# Altium project Arm Power Distro Board (A).PrjPcb
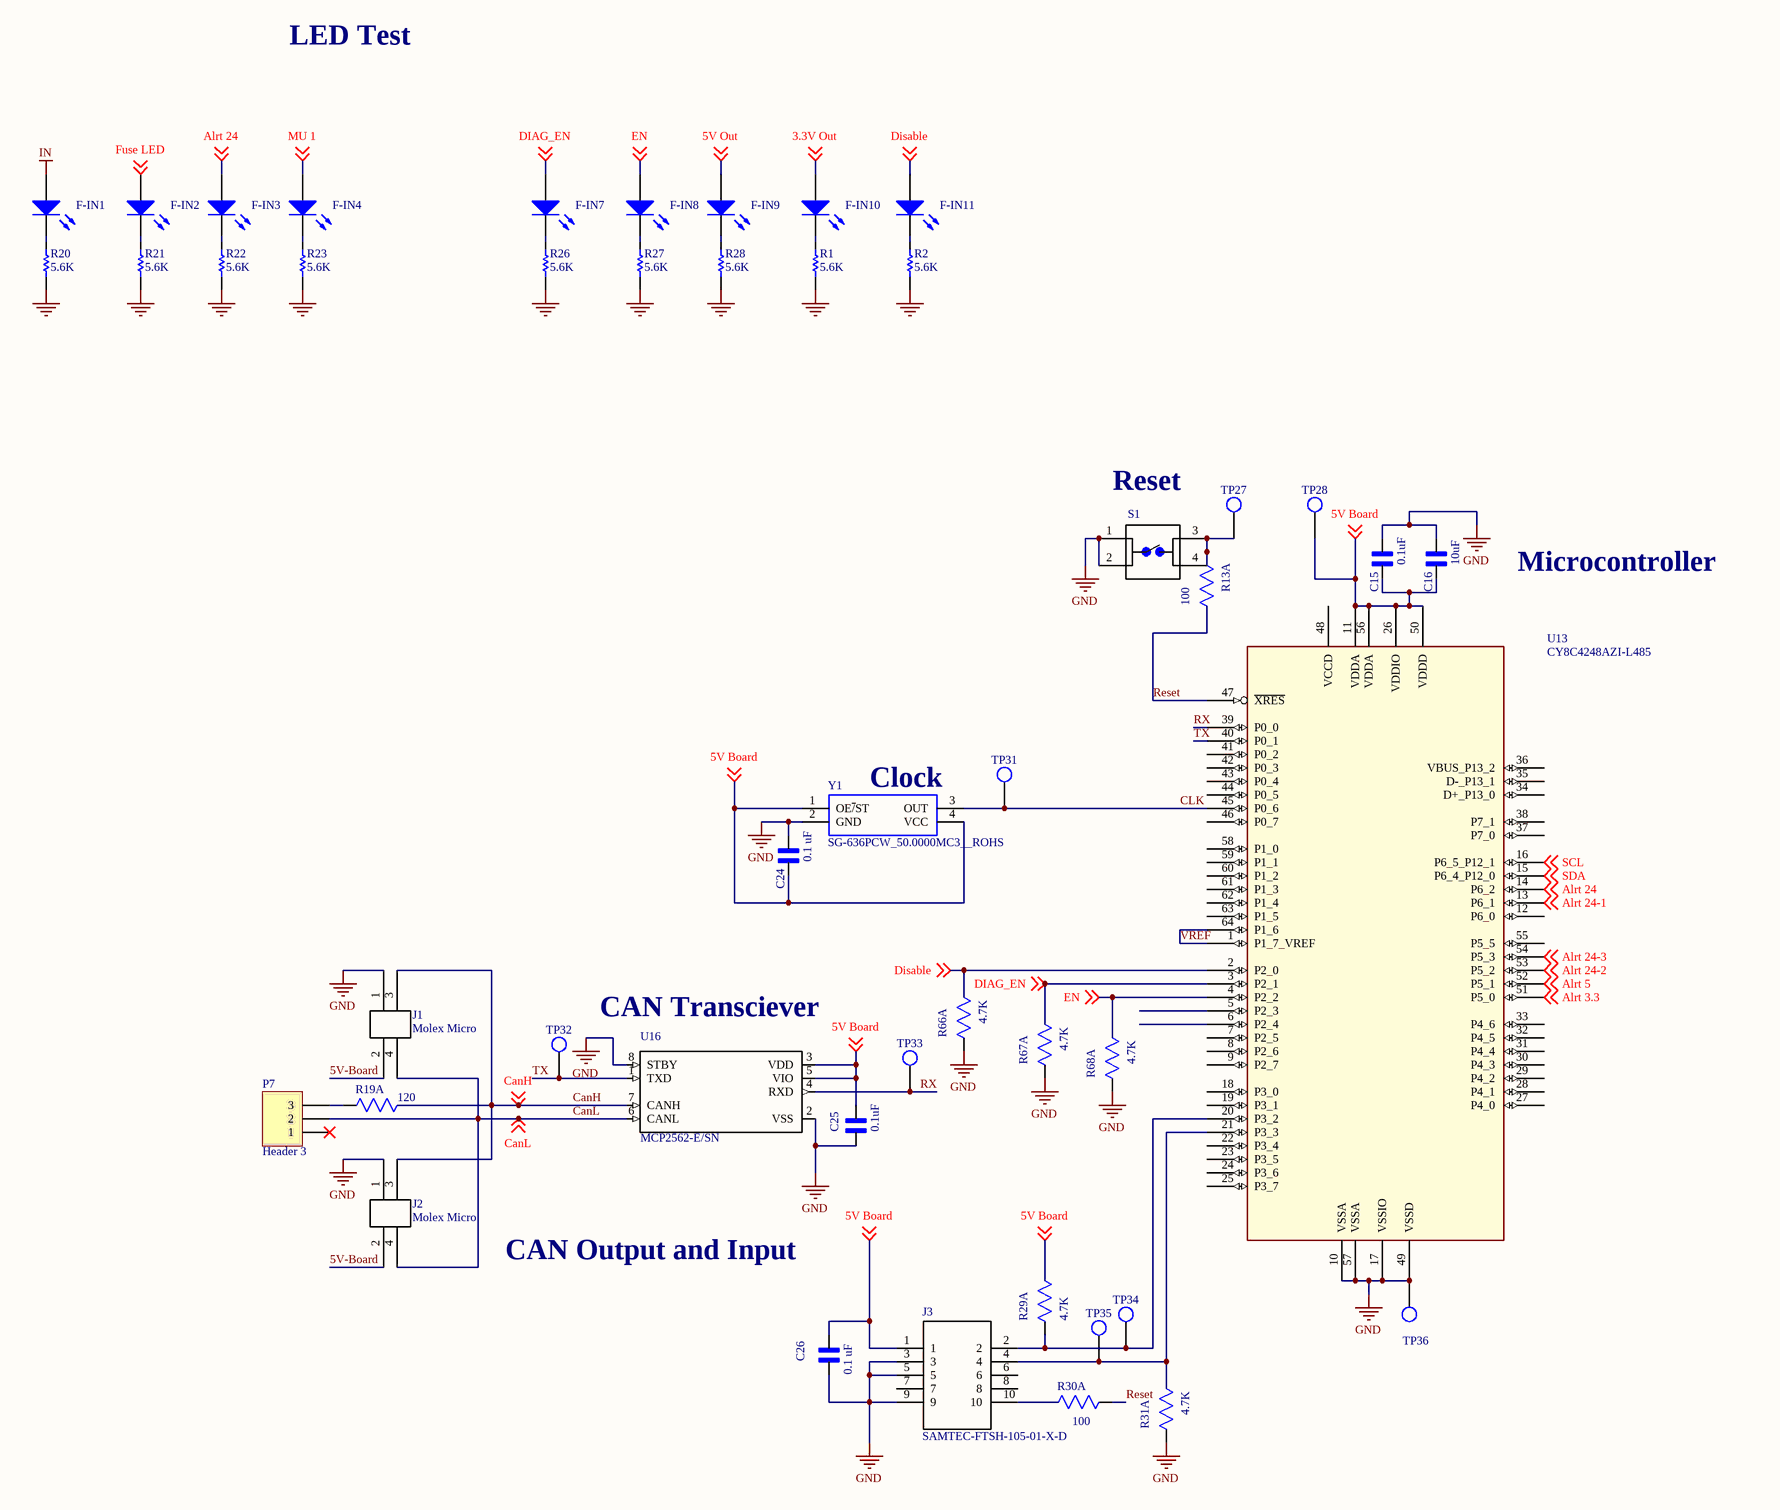
[diagram p0: Arm Power Distro Board (A).SchDoc]
6 sheets, 191 parts. Net scope: global (net labels, ports and power ports of the same name join across sheets).
Board file: Arm Power Distro Board (A).PcbDoc
Sheets:
  Arm Power Distro Board (A).SchDoc
  DC-DC Converters.SchDoc
  Input.SchDoc
  Output - Motor Units.SchDoc
  Linear Voltage Regulator.SchDoc
  Output - 24V.SchDoc

## Sheet Arm Power Distro Board (A).SchDoc
size C

### Parts
C15  0.1uF  [*CAPC2012X135N]
C16  10uF  [*CAPC2012X135N]
C24  0.1 uF  [*CAPC2012X135N]
C25  0.1uF  [*CAPC2012X135N]
C26  0.1 uF  [*CAPC2012X135N]
F-IN1  150060VS75000  [0603_A]  (value not drawn)
F-IN2  150060VS75000  [0603_A]  (value not drawn)
F-IN3  150060VS75000  [0603_A]  (value not drawn)
F-IN4  150060VS75000  [0603_A]  (value not drawn)
F-IN7  150060VS75000  [0603_A]  (value not drawn)
F-IN8  150060VS75000  [0603_A]  (value not drawn)
F-IN9  150060VS75000  [0603_A]  (value not drawn)
F-IN10  150060VS75000  [0603_A]  (value not drawn)
F-IN11  150060VS75000  [0603_A]  (value not drawn)
J1  Molex Micro  [0430450427]
J2  Molex Micro  [0430450427]
J3  SAMTEC-FTSH-105-01-X-D  [SAMTEC-FTSH-105-01-X-D]
P7  Header 3  [HDR1X3]
R1  5.6K  [RESC2013X60X35ML10T20]
R2  5.6K  [RESC2013X60X35ML10T20]
R13  100  [RC0805N]  (part A of 2)
R19  120  [RC0805N]  (part A of 2)
R20  5.6K  [RESC2013X60X35ML10T20]
R21  5.6K  [RESC2013X60X35ML10T20]
R22  5.6K  [RESC2013X60X35ML10T20]
R23  5.6K  [RESC2013X60X35ML10T20]
R26  5.6K  [RESC2013X60X35ML10T20]
R27  5.6K  [RESC2013X60X35ML10T20]
R28  5.6K  [RESC2013X60X35ML10T20]
R29  4.7K  [RC0805N]  (part A of 2)
R30  100  [RC0805N]  (part A of 2)
R31  4.7K  [RC0805N]  (part A of 2)
R66  4.7K  [RC0805N]  (part A of 2)
R67  4.7K  [RC0805N]  (part A of 2)
R68  4.7K  [RC0805N]  (part A of 2)
S1  1825910-7  [Switch 6mm 24V (NO)]  (value not drawn)
TP27  Test Point  [Test Point Through-hole]  (value not drawn)
TP28  Test Point  [Test Point Through-hole]  (value not drawn)
TP31  Test Point  [Test Point Through-hole]  (value not drawn)
TP32  Test Point  [Test Point Through-hole]  (value not drawn)
TP33  Test Point  [Test Point Through-hole]  (value not drawn)
TP34  Test Point  [Test Point Through-hole]  (value not drawn)
TP35  Test Point  [Test Point Through-hole]  (value not drawn)
TP36  Test Point  [Test Point Through-hole]  (value not drawn)
U13  CY8C4248AZI-L485  [TQFP50P1200X1200X160-64N]
U16  MCP2562-E/SN  [SOIC127P600X175-8N]
Y1  SG-636PCW_50.0000MC3__ROHS  [SG-636]

### Nets
5V Board: C15.1 C16.1 C24.1 C25.2 C26.2 J3.1 R29.2 TP28.1 U13.11(VDDA) U13.26(VDDIO) U13.50(VDDD) U13.56(VDDA) U16.3(VDD) U16.5(VIO) Y1.1(OE~{/}ST) Y1.4(VCC) ; off-sheet 5V Board  [project net 5V]
GND: C15.2 C16.2 C24.2 C25.1 C26.1 J1.1 J2.1 J3.3 J3.5 J3.9 R1.1 R2.1 R20.1 R21.1 R22.1 R23.1 R26.1 R27.1 R28.1 R31.1 R66.1 R67.1 R68.1 S1.1 S1.2 TP36.1 U13.10(VSSA) U13.17(VSSIO) U13.49(VSSD) U13.57(VSSA) U16.2(VSS) U16.8(STBY) Y1.2(GND)
IN: F-IN1.2(A)
3.3V Out: F-IN10.2(A) ; off-sheet 3.3V Out  [project net 3.3V-Out]
5V Out: F-IN9.2(A) ; off-sheet 5V Out  [project net 5V-Out]
5V-Board: J1.2 J2.2
Alrt 3.3: U13.51(P5_0) ; off-sheet Alrt 3.3
Alrt 5: U13.52(P5_1) ; off-sheet Alrt 5
Alrt 24: F-IN3.2(A) U13.14(P6_2) ; off-sheet Alrt 24
Alrt 24-1: U13.13(P6_1) ; off-sheet Alrt 24-1
Alrt 24-2: U13.53(P5_2) ; off-sheet Alrt 24-2
Alrt 24-3: U13.54(P5_3) ; off-sheet Alrt 24-3
CanH: J1.3 J2.3 R19.2 U16.7(CANH) ; off-sheet CanH
CanL: J1.4 J2.4 P7.2 U16.6(CANL) ; off-sheet CanL
CLK: TP31.1 U13.45(P0_6) Y1.3(OUT)
DIAG_EN: F-IN7.2(A) R67.2 U13.3(P2_1) ; off-sheet DIAG_EN
Disable: F-IN11.2(A) R66.2 U13.2(P2_0) ; off-sheet Disable  [project net 3.3V Disable]
EN: F-IN8.2(A) R68.2 U13.4(P2_2) ; off-sheet EN
Fuse LED: F-IN2.2(A) ; off-sheet Fuse LED
MU 1: F-IN4.2(A) ; off-sheet MU 1
Reset: R13.2 R30.1 U13.47(~{XRES})
RX: TP33.1 U13.39(P0_0) U16.4(RXD)
SCL: U13.16(P6_5_P12_1) ; off-sheet SCL
SDA: U13.15(P6_4_P12_0) ; off-sheet SDA
TX: TP32.1 U13.40(P0_1) U16.1(TXD)
VREF: U13.1(P1_7_VREF) U13.64(P1_6)
NetF-IN1_1: F-IN1.1(K) R20.2
NetF-IN2_1: F-IN2.1(K) R21.2
NetF-IN3_1: F-IN3.1(K) R22.2
NetF-IN4_1: F-IN4.1(K) R23.2
NetF-IN7_1: F-IN7.1(K) R26.2
NetF-IN8_1: F-IN8.1(K) R27.2
NetF-IN9_1: F-IN9.1(K) R28.2
NetF-IN10_1: F-IN10.1(K) R1.2
NetF-IN11_1: F-IN11.1(K) R2.2
NetJ3_2: J3.2 R29.1 TP34.1 U13.20(P3_2)
NetJ3_4: J3.4 R31.2 TP35.1 U13.21(P3_3)
NetJ3_10: J3.10 R30.2
NetP7_3: P7.3 R19.1
NetR13_1: R13.1 S1.3 S1.4 TP27.1

Not connected (* = marked no-connect by the designer): J3 6 7 8; P7 1*; U13 5(P2_3) 6(P2_4) 7(P2_5) 8(P2_6) 9(P2_7) 12(P6_0) 18(P3_0) 19(P3_1) 22(P3_4) 23(P3_5) 24(P3_6) 25(P3_7) 27(P4_0) 28(P4_1) 29(P4_2) 30(P4_3) 31(P4_4) 32(P4_5) 33(P4_6) 34(D+_P13_0) 35(D-_P13_1) 36(VBUS_P13_2) 37(P7_0) 38(P7_1) 41(P0_2) 42(P0_3) 43(P0_4) 44(P0_5) 46(P0_7) 48(VCCD) 55(P5_5) 58(P1_0) 59(P1_1) 60(P1_2) 61(P1_3) 62(P1_4) 63(P1_5)

### Notes on the sheet
- LED Test
- Reset
- Microcontroller
- (near Y1) Clock
- CAN Transciever
- CAN Output and Input

### Library data of the parts
C15 C16 C24-C26 = EMK212BJ225KG-T: / Cap Ceramic 2.2uF 16V X5R 10% SMD 0805 125Â°C Embossed T/R /; MF: Taiyo Yuden; MP: EMK212BJ225KG-T; Package: 2012 Taiyo Yuden; Digi-Key_Purchase_URL: https://www.digikey.com/product-detail/en/taiyo-yuden/EMK212BJ225KG-T/587-1293-1-ND/931070?utm_source=snapeda&utm_medium=aggregator&utm_campaign=symbol; Digi-Key_Part_Number: 587-1293-1-ND; SnapEDA_Link: https://www.snapeda.com/parts/EMK212BJ225KG-T/Taiyo%20Yuden/view-part/?ref=snap; Value: *
F-IN1-F-IN4 F-IN7-F-IN11 = CMP-1426-00006-1: SMD mono-color Chip LED, WL-SMCW, Bright Green; Manufacturer: Wuerth Elektronik; ComponentLink2URL: http://katalog.we-online.com/led/datasheet/150060VS75000.pdf; ComponentLink1Description: Manufacturer URL; PackageReference: 0603_A; PartNumber: 150060VS75000; ComponentLink2Description: Datasheet; ComponentLink1URL: http://www.we-online.com; Color: Bright Green
J1 J2 = Molex micro-fit 4-pin (dual row schematic): Molex micro-fit 3.0, P/N 0430450427
P7 = Header 3: Header, 3-Pin; LatestRevisionDate: 17-Jul-2002; LatestRevisionNote: Re-released for DXP Platform.; Publisher: Altium Limited
R1 R2 R20-R23 R26-R28 = CMP-2001-01101-2: RES SMD 36K OHM 1% 1/8W 0805; Manufacturer: Yageo; Part Number: RC0805FR-0736KL; Datasheet: http://www.yageo.com/documents/recent/PYu-RC_Group_51_RoHS_L_04.pdf
R13 R19 R29-R31 R66-R68 = CRCW0805681RFKEA: No Description Available; Manufacturer_Part_Number: CRCW0805681RFKEA_1; Vendor: Vishay; Built_By: EMA_UL_Team; Copyright: Copyright (C) 2018 Accelerated Designs. All rights reserved; RefDes: RefDes; Type: DEV; Value: Value
S1 = Switch 6mm 24V (NO): FSM4JAH=6MM TACT SWITCH, HIGH TEMP; MF: TE Connectivity; Contact_Current_Rating: 50 mA; Configuration_Pole-Throw: Single Pole - Single Throw; Package: None; Digi-Key_Part_Number: 450-1804-ND; Digi-Key_Purchase_URL: https://www.digikey.com/product-detail/en/te-connectivity-alcoswitch-switches/1825910-7/450-1804-ND/1731414?utm_source=snapeda&utm_medium=aggregator&utm_campaign=symbol; MP: 1825910-7; SnapEDA_Link: https://www.snapeda.com/parts/1825910-7/TE%20Connectivity%20ALCOSWITCH%20Switches/view-part/?ref=snap; EU_RoHS_Compliance: Compliant; TE_purchase_URL: https://www.te.com/usa-en/product-1825910-7.html?te_bu=Cor&te_type=disp&te_campaign=seda_glo_cor-seda-global-disp-prtnr-fy19-seda-model-bom-cta_sma-317_1&elqCampaignId=32493; Value: *
U16 = MCP2562-E/SN: Microchip MCP2562-E/SN, CAN Transceiver 1MBps 1-channel IEC 61000-4-2, 8-Pin SOIC; Price: None; MF: Microchip; SnapEDA_Link: https://www.snapeda.com/parts/MCP2562-E/SN/Microchip/view-part/?ref=snap; MP: MCP2562-E/SN; Availability: Unavailable; Package: SO-8 Microchip; Value: *
Y1 = SG-636: Standard Clock Oscillators 50MHz 3.3Volt 100ppm -20C +70C; Manufacturer_Name: Epson Timing; Manufacturer_Part_Number: SG-636PCW 50.0000MC3: ROHS; RS Part Number: *; RS Price/Stock: *; Arrow Part Number: SG-636PCW 50.0000MC3: ROHS; Arrow Price/Stock: *; Datasheet Link: http://www.mouser.com/ds/2/137/G-636PCE_en-1003252.pdf
U13 = CY8C4248AZI-L485: Part_Number: CY8C4248AZI-L485

## Sheet DC-DC Converters.SchDoc
size B
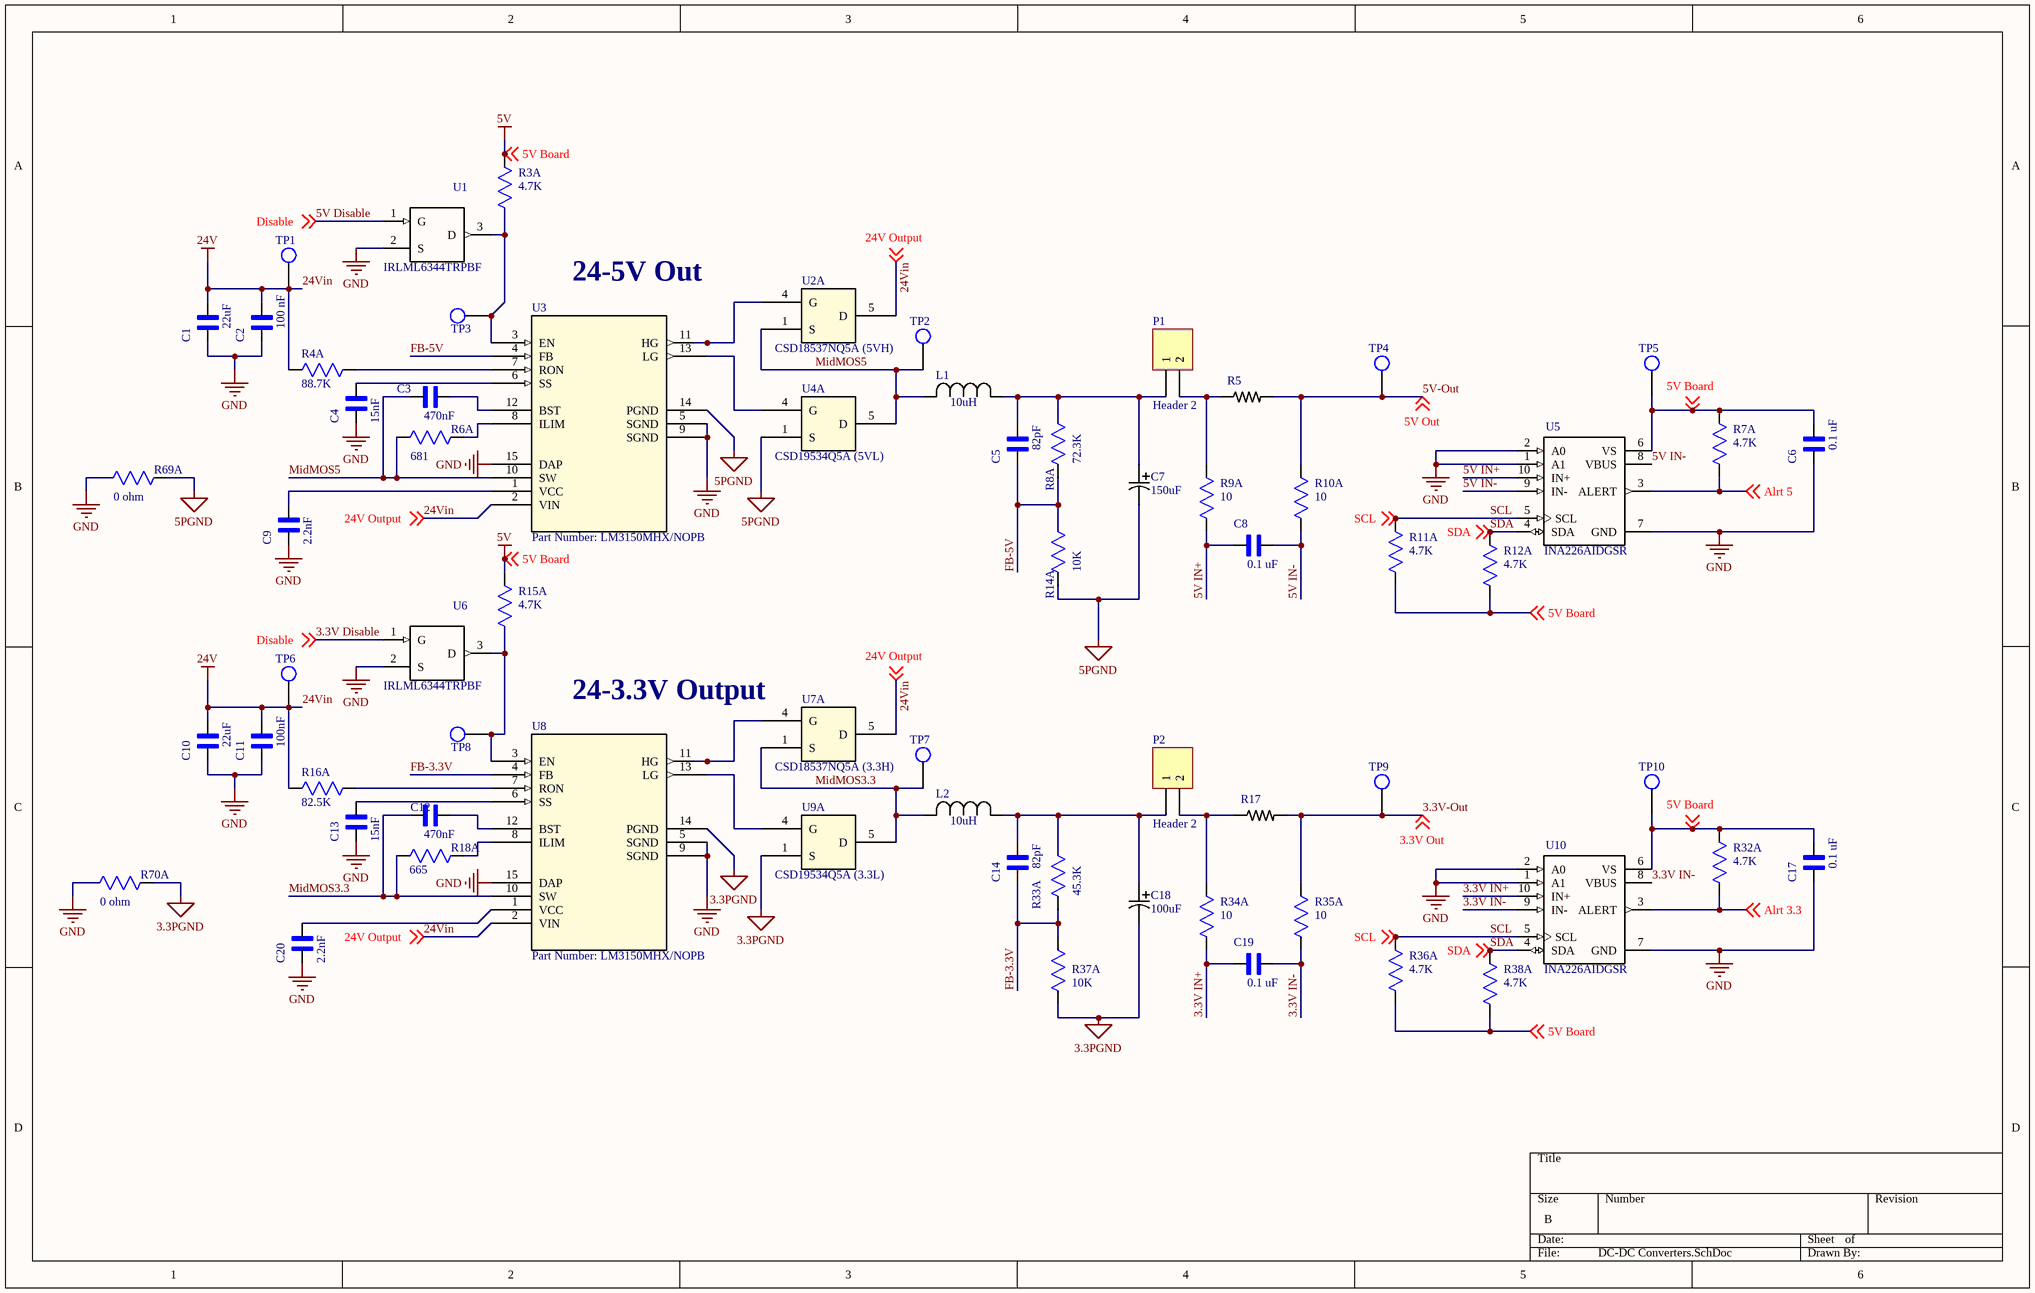
[diagram p1: DC-DC Converters.SchDoc]

### Parts
C1  22uF  [*CAPC2012X135N]
C2  100 nF  [*CAPC2012X135N]
C3  470nF  [*CAPC2012X135N]
C4  15nF  [*CAPC2012X135N]
C5  82pF  [*CAPC2012X135N]
C6  0.1 uF  [*CAPC2012X135N]
C7  150uF  [PCAP_TPE_B2]
C8  0.1 uF  [*CAPC2012X135N]
C9  2.2nF  [*CAPC2012X135N]
C10  22uF  [*CAPC2012X135N]
C11  100nF  [*CAPC2012X135N]
C12  470nF  [*CAPC2012X135N]
C13  15nF  [*CAPC2012X135N]
C14  82pF  [*CAPC2012X135N]
C17  0.1 uF  [*CAPC2012X135N]
C18  100uF  [PCAP_TPE_B2]
C19  0.1 uF  [*CAPC2012X135N]
C20  2.2nF  [*CAPC2012X135N]
L1  10uH  [IND_BOURNS_SRP12]
L2  10uH  [IND_BOURNS_SRP12]
P1  Header 2  [HDR1X2]
P2  Header 2  [HDR1X2]
R3  4.7K  [RC0805N]  (part A of 2)
R4  88.7K  [RC0805N]  (part A of 2)
R5  1-1879378-2  [*RESC6331X70N]  (value not drawn)
R6  681  [RC0805N]  (part A of 2)
R7  4.7K  [RC0805N]  (part A of 2)
R8  72.3K  [RC0805N]  (part A of 2)
R9  10  [RC0805N]  (part A of 2)
R10  10  [RC0805N]  (part A of 2)
R11  4.7K  [RC0805N]  (part A of 2)
R12  4.7K  [RC0805N]  (part A of 2)
R14  10K  [RC0805N]  (part A of 2)
R15  4.7K  [RC0805N]  (part A of 2)
R16  82.5K  [RC0805N]  (part A of 2)
R17  1-1879378-2  [*RESC6331X70N]  (value not drawn)
R18  665  [RC0805N]  (part A of 2)
R32  4.7K  [RC0805N]  (part A of 2)
R33  45.3K  [RC0805N]  (part A of 2)
R34  10  [RC0805N]  (part A of 2)
R35  10  [RC0805N]  (part A of 2)
R36  4.7K  [RC0805N]  (part A of 2)
R37  10K  [RC0805N]  (part A of 2)
R38  4.7K  [RC0805N]  (part A of 2)
R69  0 ohm  [RC0805N]  (part A of 2)
R70  0 ohm  [RC0805N]  (part A of 2)
TP1  Test Point  [Test Point Through-hole]  (value not drawn)
TP2  Test Point  [Test Point Through-hole]  (value not drawn)
TP3  Test Point  [Test Point Through-hole]  (value not drawn)
TP4  Test Point  [Test Point Through-hole]  (value not drawn)
TP5  Test Point  [Test Point Through-hole]  (value not drawn)
TP6  Test Point  [Test Point Through-hole]  (value not drawn)
TP7  Test Point  [Test Point Through-hole]  (value not drawn)
TP8  Test Point  [Test Point Through-hole]  (value not drawn)
TP9  Test Point  [Test Point Through-hole]  (value not drawn)
TP10  Test Point  [Test Point Through-hole]  (value not drawn)
U1  IRLML6344TRPBF  [*SOT95P240X112-3N]
U2  CSD18537NQ5A (5VH)  [*TRANS_BSC076N06NS3-G]  (part A of 2)
U3  Part Number: LM3150MHX/NOPB  [MXA14A]
U4  CSD19534Q5A (5VL)  [DQJ8]  (part A of 2)
U5  INA226AIDGSR  [*SOP50P490X110-10N]
U6  IRLML6344TRPBF  [*SOT95P240X112-3N]
U7  CSD18537NQ5A (3.3H)  [DQJ8]  (part A of 2)
U8  Part Number: LM3150MHX/NOPB  [MXA14A]
U9  CSD19534Q5A (3.3L)  [DQJ8]  (part A of 2)
U10  INA226AIDGSR  [*SOP50P490X110-10N]

### Nets
3.3PGND: C18.2 R70.1 U8.14(PGND) U9.1(S)
5PGND: C7.2 R14.1 R69.1 U3.14(PGND) U4.1(S)
5V: C6.2 C17.2 R3.1 R7.1 R15.1 R32.1 TP5.1 TP10.1 U5.6(VS) U10.6(VS) ; off-sheet 5V Board   [also labelled 5V Board ]
24Vin: C1.2 C2.2 C10.2 C11.2 TP1.1 TP6.1 U2.5(D) U3.2(VIN) U7.5(D) U8.2(VIN) ; off-sheet 24V Output   [also labelled 24V, 24V Output ]
GND: C1.1 C2.1 C4.1 C6.1 C9.1 C10.1 C11.1 C13.1 C17.1 C20.1 R69.2 R70.2 U1.2(S) U3.5(SGND) U3.9(SGND) U3.15(DAP) U5.1(A1) U5.2(A0) U5.7(GND) U6.2(S) U8.5(SGND) U8.9(SGND) U8.15(DAP) U10.1(A1) U10.2(A0) U10.7(GND)
3.3V Disable: U1.1(G) U6.1(G) ; off-sheet Disable   [also labelled 5V Disable, Disable ]
3.3V IN+: C19.1 U10.10(IN+)
3.3V IN-: C19.2 U10.8(VBUS) U10.9(IN-)
3.3V-Out: R17.2 R35.1 TP9.1 ; off-sheet 3.3V Out  [also labelled 3.3V Out]
5V IN+: C8.1 U5.10(IN+)
5V IN-: C8.2 U5.8(VBUS) U5.9(IN-)
5V-Out: R5.2 R10.1 TP4.1 ; off-sheet 5V Out  [also labelled 5V Out]
Alrt 3.3: U10.3(ALERT) ; off-sheet Alrt 3.3
Alrt 5: U5.3(ALERT) ; off-sheet Alrt 5
FB-3.3V: C14.1 R33.1 R37.1 U8.4(FB)
FB-5V: C5.1 R8.1 R14.2 U3.4(FB)
MidMOS3.3: C12.1 L2.2 TP7.1 U7.1(S) U8.10(SW) U9.5(D)
MidMOS5: C3.1 L1.2 TP2.1 U2.1(S) U3.10(SW) U4.5(D)
SCL: R11.1 R36.1 U5.5(SCL) U10.5(SCL) ; off-sheet SCL
SDA: R12.1 R38.1 U5.4(SDA) U10.4(SDA) ; off-sheet SDA
NetC3_2: C3.2 U3.12(BST)
NetC4_2: C4.2 U3.6(SS)
NetC5_2: C5.2 C7.1 L1.1 P1.1 R8.2
NetC9_2: C9.2 U3.1(VCC)
NetC12_2: C12.2 U8.12(BST)
NetC13_2: C13.2 U8.6(SS)
NetC14_2: C14.2 C18.1 L2.1 P2.1 R33.2
NetC20_2: C20.2 U8.1(VCC)
NetP1_2: P1.2 R5.1 R9.1
NetP2_2: P2.2 R17.1 R34.1
NetR3_2: R3.2 TP3.1 U1.3(D) U3.3(EN)
NetR4_1: R4.1 U3.7(RON)
NetR6_1: R6.1 U3.8(ILIM)
NetR15_2: R15.2 TP8.1 U6.3(D) U8.3(EN)
NetR16_1: R16.1 U8.7(RON)
NetR18_1: R18.1 U8.8(ILIM)
NetU2_4: U2.4(G) U3.11(HG)
NetU3_13: U3.13(LG) U4.4(G)
NetU7_4: U7.4(G) U8.11(HG)
NetU8_13: U8.13(LG) U9.4(G)

Not connected (* = marked no-connect by the designer): R4 2; R6 2; R7 2; R9 2; R10 2; R11 2; R12 2; R16 2; R18 2; R32 2; R34 2; R35 2; R36 2; R37 2; R38 2

### Notes on the sheet
- 24-5V Out
- (near U7) 24-3.3V Output

### Library data of the parts
C1-C6 C8-C14 C17 C19 C20 = EMK212BJ225KG-T: as C15 on sheet Arm Power Distro Board (A); MP: EMK212BJ225KG-T; Package: 2012 Taiyo Yuden; Digi-Key_Purchase_URL: https://www.digikey.com/product-detail/en/taiyo-yuden/EMK212BJ225KG-T/587-1293-1-ND/931070?utm_source=snapeda&utm_medium=aggregator&utm_campaign=symbol; Digi-Key_Part_Number: 587-1293-1-ND; SnapEDA_Link: https://www.snapeda.com/parts/EMK212BJ225KG-T/Taiyo%20Yuden/view-part/?ref=snap; Value: *
C7 C18 = 6TPE150MAPB: No Description Available; Vendor: Panasonic; Built_By: EMA_UL_Team; Type: DEV; Manufacturer_Part_Number: 6TPE150MAPB; Copyright: Copyright (C) 2018 Accelerated Designs. All rights reserved; RefDes: RefDes; Value: Value
L1 L2 = SRP1250-100M: No Description Available; Vendor: Bourns Electronics; Built_By: EMA_UL_Team; Type: DEV; Manufacturer_Part_Number: SRP1250-100M; Copyright: Copyright (C) 2018 Accelerated Designs. All rights reserved; RefDes: RefDes; Value: Value
P1 P2 = Header 2: Header, 2-Pin; LatestRevisionDate: 17-Jul-2002; LatestRevisionNote: Re-released for DXP Platform.; Publisher: Altium Limited
R3 R4 R6-R12 R14-R16 R18 R32-R38 R69 R70 = CRCW0805681RFKEA: as R13 on sheet Arm Power Distro Board (A); Copyright: Copyright (C) 2018 Accelerated Designs. All rights reserved; RefDes: RefDes; Type: DEV; Value: Value
R5 R17 = TLR3A20KR003FTDG: TLR 2512 2.0W R003 1% 150PPM 2K RL; Power_Rating: 2 W; MF: TE Connectivity; Resistance: .003; MP: TLR3A20KR003FTDG; Digi-Key_Purchase_URL: https://www.digikey.com/product-detail/en/te-connectivity-passive-product/TLR3A20KR003FTDG/A131783CT-ND/8603913?utm_source=snapeda&utm_medium=aggregator&utm_campaign=symbol; SnapEDA_Link: https://www.snapeda.com/parts/TLR3A20KR003FTDG/TE%20Connectivity/view-part/1169417/?ref=snap; TE_purchase_URL: https://www.te.com/usa-en/product-1-1879378-2.html?te_bu=Cor&te_type=disp&te_campaign=seda_glo_cor-seda-global-disp-prtnr-fy19-seda-model-bom-cta_sma-317_1&elqCampaignId=32493; Package: 2512; Digi-Key_Part_Number: A131783CT-ND; EU_RoHS_Compliance: Compliant; Tolerance: 1%; Value: *
U1 U6 = IRLML6344TRPBF: IRLML6344TRPBF N-channel MOSFET Transistor, 5 A, 30 V, 3-Pin SOT-23; MF: Infineon Technologies; Package: SOT-23 Infineon; SnapEDA_Link: https://www.snapeda.com/parts/IRLML6344TRPBF/Infineon%20Technologies/view-part/?ref=snap; MP: IRLML6344TRPBF; Digi-Key_Purchase_URL: https://www.digikey.com/product-detail/en/infineon-technologies/IRLML6344TRPBF/IRLML6344TRPBFCT-ND/2538168?utm_source=snapeda&utm_medium=aggregator&utm_campaign=symbol; Digi-Key_Part_Number: IRLML6344TRPBFCT-ND; Value: *
U2 U7 = CSD18537NQ5A: No Description Available; Built_By: EMA_UL_Team; Vendor: Texas Instruments; Manufacturer_Part_Number: CSD18537NQ5A; Copyright: Copyright (C) 2018 Accelerated Designs. All rights reserved; RefDes: RefDes; Type: DEV; Value: Value
U3 U8 = LM3150MHX/NOPB: No Description Available; Vendor: Texas Instruments; Built_By: EMA_UL_Team; Manufacturer_Part_Number: LM3150MHX/NOPB; Copyright: Copyright (C) 2018 Accelerated Designs. All rights reserved; RefDes: RefDes; Type: DEV; Value: Value
U4 U9 = CSD19534Q5A: No Description Available; Built_By: EMA_UL_Team; Vendor: Texas Instruments; Manufacturer_Part_Number: CSD19534Q5A; Copyright: Copyright (C) 2018 Accelerated Designs. All rights reserved; RefDes: RefDes; Type: DEV; Value: Value
U5 U10 = INA226AIDGSR: Current Monitor Regulator High/Low-Side 10mA 10-VSSOP; MF: Texas Instruments; Digi-Key_Part_Number: 296-29034-1-ND; SnapEDA_Link: https://www.snapeda.com/parts/INA226AIDGSR/Texas%20Instruments/view-part/53552/?ref=snap; Package: MSOP-10 Texas Instruments; MP: INA226AIDGSR; Digi-Key_Purchase_URL: https://www.digikey.com/product-detail/en/texas-instruments/INA226AIDGSR/296-29034-1-ND/2687118?utm_source=snapeda&utm_medium=aggregator&utm_campaign=symbol; Value: *

## Sheet Input.SchDoc
size A
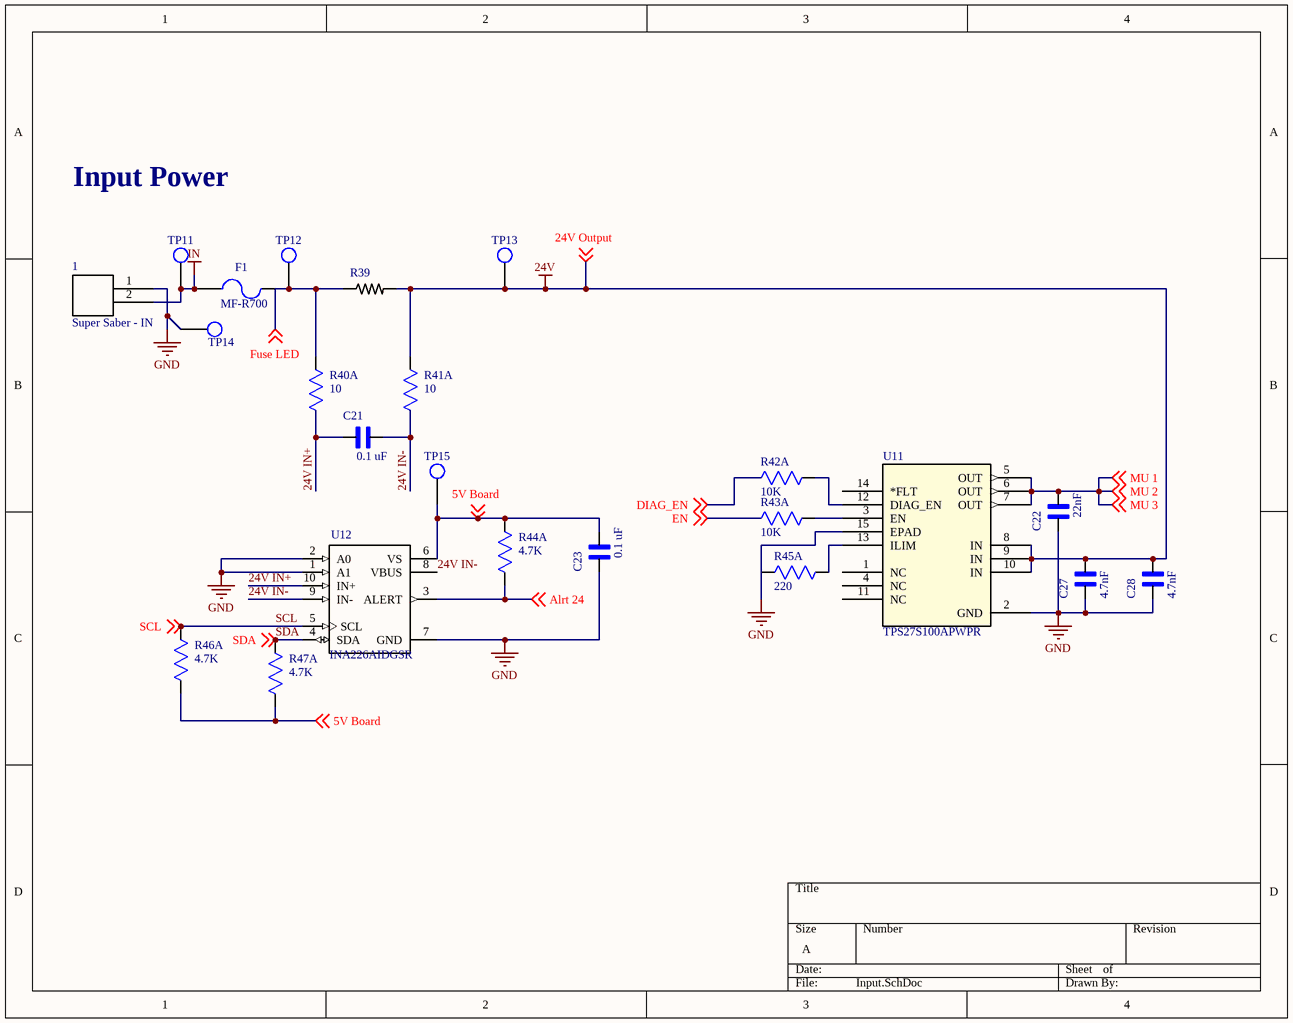
[diagram p2: Input.SchDoc]

### Parts
1  Super Saber - IN  [0431600102]
C21  0.1 uF  [*CAPC2012X135N]
C22  22nF  [*CAPC2012X135N]
C23  0.1 uF  [*CAPC2012X135N]
C27  4.7nF  [*CAPC2012X135N]
C28  4.7nF  [*CAPC2012X135N]
F1  MF-R700  [*2920_FUSE]
R39  1-1879378-2  [*RESC6331X70N]  (value not drawn)
R40  10  [RC0805N]  (part A of 2)
R41  10  [RC0805N]  (part A of 2)
R42  10K  [RC0805N]  (part A of 2)
R43  10K  [RC0805N]  (part A of 2)
R44  4.7K  [RC0805N]  (part A of 2)
R45  220  [RC0805N]  (part A of 2)
R46  4.7K  [RC0805N]  (part A of 2)
R47  4.7K  [RC0805N]  (part A of 2)
TP11  Test Point  [Test Point Through-hole]  (value not drawn)
TP12  Test Point  [Test Point Through-hole]  (value not drawn)
TP13  Test Point  [Test Point Through-hole]  (value not drawn)
TP14  Test Point  [Test Point Through-hole]  (value not drawn)
TP15  Test Point  [Test Point Through-hole]  (value not drawn)
U11  TPS27S100APWPR  [PWP14-M]
U12  INA226AIDGSR  [*SOP50P490X110-10N]

### Nets
5V Board : C23.2 R44.1 TP15.1 U12.6(VS) ; off-sheet 5V Board   [project net 5V]
24V: C27.2 C28.2 R39.2 R41.1 TP13.1 U11.8(IN) U11.9(IN) U11.10(IN) ; off-sheet 24V Output   [also labelled 24V Output ]  [project net 24Vin]
GND: 1.1 C22.1 C23.1 C27.1 C28.1 TP14.1 U11.2(GND) U11.15(EPAD) U12.1(A1) U12.2(A0) U12.7(GND)
IN: 1.2 F1.1 TP11.1
24V IN+: C21.1 R40.2 U12.10(IN+)
24V IN-: C21.2 R41.2 U12.8(VBUS) U12.9(IN-)
Alrt 24: U12.3(ALERT) ; off-sheet Alrt 24
DIAG_EN: R42.2 ; off-sheet DIAG_EN
EN: R43.2 ; off-sheet EN
Fuse LED: F1.2 R39.1 R40.1 TP12.1 ; off-sheet Fuse LED
MU 1: C22.2 U11.5(OUT) U11.6(OUT) U11.7(OUT) ; off-sheet MU 1, off-sheet MU 2, off-sheet MU 3   [also labelled MU 2, MU 3 ]
SCL: R46.1 U12.5(SCL) ; off-sheet SCL
SDA: R47.1 U12.4(SDA) ; off-sheet SDA
NetR42_1: R42.1 U11.12(DIAG_EN)
NetR43_1: R43.1 U11.3(EN)
NetR45_1: R45.1 U11.13(ILIM)

Not connected (* = marked no-connect by the designer): R44 2; R45 2; R46 2; R47 2; U11 1(NC) 4(NC) 11(NC) 14(*FLT)

### Notes on the sheet
- Input Power

### Library data of the parts
1 = Super Saber
C21-C23 C27 C28 = EMK212BJ225KG-T: as C15 on sheet Arm Power Distro Board (A); MP: EMK212BJ225KG-T; Package: 2012 Taiyo Yuden; Digi-Key_Purchase_URL: https://www.digikey.com/product-detail/en/taiyo-yuden/EMK212BJ225KG-T/587-1293-1-ND/931070?utm_source=snapeda&utm_medium=aggregator&utm_campaign=symbol; Digi-Key_Part_Number: 587-1293-1-ND; SnapEDA_Link: https://www.snapeda.com/parts/EMK212BJ225KG-T/Taiyo%20Yuden/view-part/?ref=snap; Value: *
F1 = Fuse 2: Fuse; Published: 8-Jun-2000; LatestRevisionDate: 17-Jul-2002; LatestRevisionNote: Re-released for DXP Platform.; PackageReference: PIN-W2/E2.8; Publisher: Altium Limited; PackageDescription: Thru-Hole; 2 Leads
R39 = TLR3A20KR003FTDG: as R5 on sheet DC-DC Converters; MP: TLR3A20KR003FTDG; Digi-Key_Purchase_URL: https://www.digikey.com/product-detail/en/te-connectivity-passive-product/TLR3A20KR003FTDG/A131783CT-ND/8603913?utm_source=snapeda&utm_medium=aggregator&utm_campaign=symbol; SnapEDA_Link: https://www.snapeda.com/parts/TLR3A20KR003FTDG/TE%20Connectivity/view-part/1169417/?ref=snap; TE_purchase_URL: https://www.te.com/usa-en/product-1-1879378-2.html?te_bu=Cor&te_type=disp&te_campaign=seda_glo_cor-seda-global-disp-prtnr-fy19-seda-model-bom-cta_sma-317_1&elqCampaignId=32493; Package: 2512; Digi-Key_Part_Number: A131783CT-ND; EU_RoHS_Compliance: Compliant; Tolerance: 1%; Value: *
R40-R47 = CRCW0805681RFKEA: as R13 on sheet Arm Power Distro Board (A); Copyright: Copyright (C) 2018 Accelerated Designs. All rights reserved; RefDes: RefDes; Type: DEV; Value: Value
U11 = TPS27S100APWPR: No Description Available; Built_By: EMA_Molly; Vendor: Texas Instruments; Copyright: Copyright (C) 2018 Accelerated Designs. All rights reserved; Manufacturer_Part_Number: TPS27S100APWPR; RefDes: RefDes; Type: DEV; Value: Value
U12 = INA226AIDGSR: as U5 on sheet DC-DC Converters; Digi-Key_Part_Number: 296-29034-1-ND; SnapEDA_Link: https://www.snapeda.com/parts/INA226AIDGSR/Texas%20Instruments/view-part/53552/?ref=snap; Package: MSOP-10 Texas Instruments; MP: INA226AIDGSR; Digi-Key_Purchase_URL: https://www.digikey.com/product-detail/en/texas-instruments/INA226AIDGSR/296-29034-1-ND/2687118?utm_source=snapeda&utm_medium=aggregator&utm_campaign=symbol; Value: *

## Sheet Output - Motor Units.SchDoc
size A
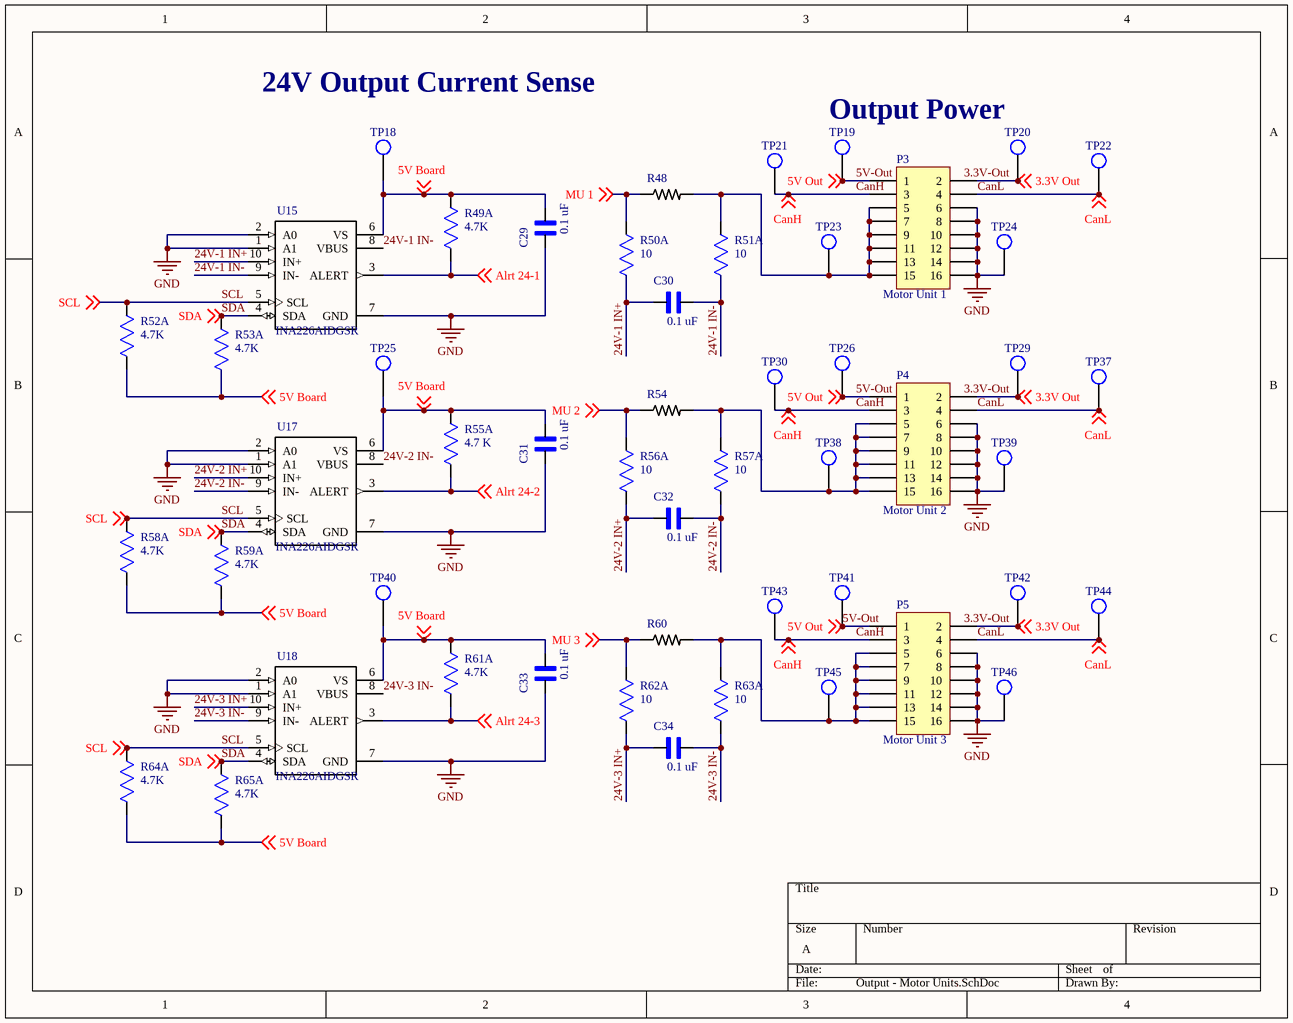
[diagram p3: Output - Motor Units.SchDoc]

### Parts
C29  0.1 uF  [*CAPC2012X135N]
C30  0.1 uF  [*CAPC2012X135N]
C31  0.1 uF  [*CAPC2012X135N]
C32  0.1 uF  [*CAPC2012X135N]
C33  0.1 uF  [*CAPC2012X135N]
C34  0.1 uF  [*CAPC2012X135N]
P3  Motor Unit 1  [HDR2X8]
P4  Motor Unit 2  [HDR2X8]
P5  Motor Unit 3  [HDR2X8]
R48  1-1879378-2  [*RESC6331X70N]  (value not drawn)
R49  4.7K  [RC0805N]  (part A of 2)
R50  10  [RC0805N]  (part A of 2)
R51  10  [RC0805N]  (part A of 2)
R52  4.7K  [RC0805N]  (part A of 2)
R53  4.7K  [RC0805N]  (part A of 2)
R54  1-1879378-2  [*RESC6331X70N]  (value not drawn)
R55  4.7 K  [RC0805N]  (part A of 2)
R56  10  [RC0805N]  (part A of 2)
R57  10  [RC0805N]  (part A of 2)
R58  4.7K  [RC0805N]  (part A of 2)
R59  4.7K  [RC0805N]  (part A of 2)
R60  1-1879378-2  [*RESC6331X70N]  (value not drawn)
R61  4.7K  [RC0805N]  (part A of 2)
R62  10  [RC0805N]  (part A of 2)
R63  10  [RC0805N]  (part A of 2)
R64  4.7K  [RC0805N]  (part A of 2)
R65  4.7K  [RC0805N]  (part A of 2)
TP18  Test Point  [Test Point Through-hole]  (value not drawn)
TP19  Test Point  [Test Point Through-hole]  (value not drawn)
TP20  Test Point  [Test Point Through-hole]  (value not drawn)
TP21  Test Point  [Test Point Through-hole]  (value not drawn)
TP22  Test Point  [Test Point Through-hole]  (value not drawn)
TP23  Test Point  [Test Point Through-hole]  (value not drawn)
TP24  Test Point  [Test Point Through-hole]  (value not drawn)
TP25  Test Point  [Test Point Through-hole]  (value not drawn)
TP26  Test Point  [Test Point Through-hole]  (value not drawn)
TP29  Test Point  [Test Point Through-hole]  (value not drawn)
TP30  Test Point  [Test Point Through-hole]  (value not drawn)
TP37  Test Point  [Test Point Through-hole]  (value not drawn)
TP38  Test Point  [Test Point Through-hole]  (value not drawn)
TP39  Test Point  [Test Point Through-hole]  (value not drawn)
TP40  Test Point  [Test Point Through-hole]  (value not drawn)
TP41  Test Point  [Test Point Through-hole]  (value not drawn)
TP42  Test Point  [Test Point Through-hole]  (value not drawn)
TP43  Test Point  [Test Point Through-hole]  (value not drawn)
TP44  Test Point  [Test Point Through-hole]  (value not drawn)
TP45  Test Point  [Test Point Through-hole]  (value not drawn)
TP46  Test Point  [Test Point Through-hole]  (value not drawn)
U15  INA226AIDGSR  [*SOP50P490X110-10N]
U17  INA226AIDGSR  [*SOP50P490X110-10N]
U18  INA226AIDGSR  [*SOP50P490X110-10N]

### Nets
5V Board : C29.2 C31.2 C33.2 R49.1 R53.2 R55.1 R61.1 TP18.1 TP25.1 TP40.1 U15.6(VS) U17.6(VS) U18.6(VS) ; off-sheet 5V Board   [project net 5V]
GND: C29.1 C31.1 C33.1 P3.6 P3.8 P3.10 P3.12 P3.14 P3.16 P4.6 P4.8 P4.10 P4.12 P4.14 P4.16 P5.6 P5.8 P5.10 P5.12 P5.14 P5.16 TP24.1 TP39.1 TP46.1 U15.1(A1) U15.2(A0) U15.7(GND) U17.1(A1) U17.2(A0) U17.7(GND) U18.1(A1) U18.2(A0) U18.7(GND)
3.3V Out: P3.2 P4.2 P5.2 TP20.1 TP29.1 TP42.1 ; off-sheet 3.3V Out  [project net 3.3V-Out]
5V-Out: P3.1 P4.1 P5.1 TP19.1 TP26.1 TP41.1 ; off-sheet 5V Out  [also labelled 5V Out]
24V-1 IN+: C30.1 R50.2 U15.10(IN+)
24V-1 IN-: C30.2 R51.2 U15.8(VBUS) U15.9(IN-)
24V-2 IN+: C32.1 U17.10(IN+)
24V-2 IN-: C32.2 U17.8(VBUS) U17.9(IN-)
24V-3 IN+: C34.1 U18.10(IN+)
24V-3 IN-: C34.2 U18.8(VBUS) U18.9(IN-)
Alrt 24-1: U15.3(ALERT) ; off-sheet Alrt 24-1
Alrt 24-2: U17.3(ALERT) ; off-sheet Alrt 24-2
Alrt 24-3: U18.3(ALERT) ; off-sheet Alrt 24-3
CanH: P3.3 P4.3 P5.3 TP21.1 TP30.1 TP43.1 ; off-sheet CanH
CanL: P3.4 P4.4 P5.4 TP22.1 TP37.1 TP44.1 ; off-sheet CanL
MU 1: R48.1 R50.1 R54.1 R56.1 R60.1 R62.1 ; off-sheet MU 1, off-sheet MU 2, off-sheet MU 3  [also labelled MU 2, MU 3]
SCL: R52.1 R58.1 R64.1 U15.5(SCL) U17.5(SCL) U18.5(SCL) ; off-sheet SCL
SDA: R53.1 R59.1 R65.1 U15.4(SDA) U17.4(SDA) U18.4(SDA) ; off-sheet SDA
NetP3_5: P3.5 P3.7 P3.9 P3.11 P3.13 P3.15 R48.2 R51.1 TP23.1
NetP4_5: P4.5 P4.7 P4.9 P4.11 P4.13 P4.15 R54.2 R57.1 TP38.1
NetP5_5: P5.5 P5.7 P5.9 P5.11 P5.13 P5.15 R60.2 R63.1 TP45.1

Not connected (* = marked no-connect by the designer): R49 2; R52 2; R55 2; R56 2; R57 2; R58 2; R59 2; R61 2; R62 2; R63 2; R64 2; R65 2

### Notes on the sheet
- 24V Output Current Sense
- Output Power
- Labels drawn without touching a wire or pin: 3.3V-Out

### Library data of the parts
C29-C34 = EMK212BJ225KG-T: as C15 on sheet Arm Power Distro Board (A); MP: EMK212BJ225KG-T; Package: 2012 Taiyo Yuden; Digi-Key_Purchase_URL: https://www.digikey.com/product-detail/en/taiyo-yuden/EMK212BJ225KG-T/587-1293-1-ND/931070?utm_source=snapeda&utm_medium=aggregator&utm_campaign=symbol; Digi-Key_Part_Number: 587-1293-1-ND; SnapEDA_Link: https://www.snapeda.com/parts/EMK212BJ225KG-T/Taiyo%20Yuden/view-part/?ref=snap; Value: *
P3-P5 = Header 8X2: Header, 8-Pin, Dual row; LatestRevisionDate: 17-Jul-2002; LatestRevisionNote: Re-released for DXP Platform.; Publisher: Altium Limited
R48 R54 R60 = TLR3A20KR003FTDG: as R5 on sheet DC-DC Converters; MP: TLR3A20KR003FTDG; Digi-Key_Purchase_URL: https://www.digikey.com/product-detail/en/te-connectivity-passive-product/TLR3A20KR003FTDG/A131783CT-ND/8603913?utm_source=snapeda&utm_medium=aggregator&utm_campaign=symbol; SnapEDA_Link: https://www.snapeda.com/parts/TLR3A20KR003FTDG/TE%20Connectivity/view-part/1169417/?ref=snap; TE_purchase_URL: https://www.te.com/usa-en/product-1-1879378-2.html?te_bu=Cor&te_type=disp&te_campaign=seda_glo_cor-seda-global-disp-prtnr-fy19-seda-model-bom-cta_sma-317_1&elqCampaignId=32493; Package: 2512; Digi-Key_Part_Number: A131783CT-ND; EU_RoHS_Compliance: Compliant; Tolerance: 1%; Value: *
R49-R53 R55-R59 R61-R65 = CRCW0805681RFKEA: as R13 on sheet Arm Power Distro Board (A); Copyright: Copyright (C) 2018 Accelerated Designs. All rights reserved; RefDes: RefDes; Type: DEV; Value: Value
U15 U17 U18 = INA226AIDGSR: as U5 on sheet DC-DC Converters; Digi-Key_Part_Number: 296-29034-1-ND; SnapEDA_Link: https://www.snapeda.com/parts/INA226AIDGSR/Texas%20Instruments/view-part/53552/?ref=snap; Package: MSOP-10 Texas Instruments; MP: INA226AIDGSR; Digi-Key_Purchase_URL: https://www.digikey.com/product-detail/en/texas-instruments/INA226AIDGSR/296-29034-1-ND/2687118?utm_source=snapeda&utm_medium=aggregator&utm_campaign=symbol; Value: *

## Sheet Linear Voltage Regulator.SchDoc
size A
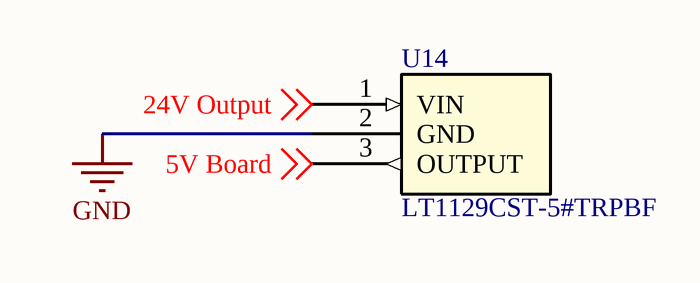
[diagram p4: Linear Voltage Regulator.SchDoc]

### Parts
U14  LT1129CST-5#TRPBF  [SOT-223_ST-M]

### Nets
5V Board: U14.3(OUTPUT) ; off-sheet 5V Board  [project net 5V]
24V Output: U14.1(VIN) ; off-sheet 24V Output  [project net 24Vin]
GND: U14.2(GND)

### Library data of the parts
U14 = LT1129CST-5#TRPB: No Description Available; Vendor: Linear Technology; Built_By: EMA_UL_Team; Manufacturer_Part_Number: LT1129CST-5#TRPBF; Copyright: Copyright (C) 2018 Accelerated Designs. All rights reserved; RefDes: RefDes; Type: DEV; Value: Value

## Sheet Output - 24V.SchDoc
size A
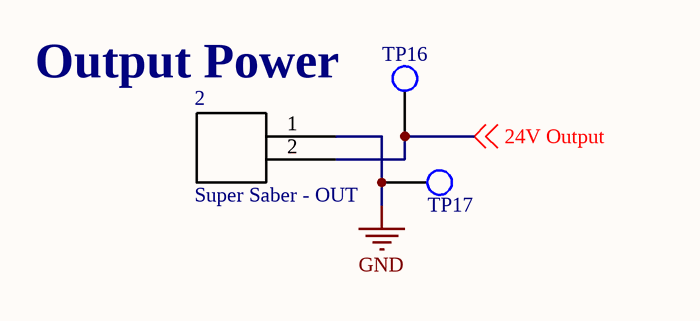
[diagram p5: Output - 24V.SchDoc]

### Parts
2  Super Saber - OUT  [0431600102]
TP16  Test Point  [Test Point Through-hole]  (value not drawn)
TP17  Test Point  [Test Point Through-hole]  (value not drawn)

### Nets
24V Output : 2.2 TP16.1 ; off-sheet 24V Output   [project net 24Vin]
GND: 2.1 TP17.1

### Notes on the sheet
- Output Power

### Library data of the parts
2 = Super Saber

## Nets that join several sheets
5V: Arm Power Distro Board (A) (16 pins), DC-DC Converters (10 pins), Input (C23.2 R44.1 TP15.1 U12.6), Output - Motor Units (13 pins), Linear Voltage Regulator (U14.3)
24Vin: DC-DC Converters (10 pins), Input (8 pins), Linear Voltage Regulator (U14.1), Output - 24V (2.2 TP16.1)
GND: Arm Power Distro Board (A) (33 pins), DC-DC Converters (26 pins), Input (11 pins), Output - Motor Units (33 pins), Linear Voltage Regulator (U14.2), Output - 24V (2.1 TP17.1)
IN: Arm Power Distro Board (A) (F-IN1.2), Input (1.2 F1.1 TP11.1)
3.3V Disable: Arm Power Distro Board (A) (F-IN11.2 R66.2 U13.2), DC-DC Converters (U1.1 U6.1)
3.3V-Out: Arm Power Distro Board (A) (F-IN10.2), DC-DC Converters (R17.2 R35.1 TP9.1), Output - Motor Units (6 pins)
5V-Out: Arm Power Distro Board (A) (F-IN9.2), DC-DC Converters (R5.2 R10.1 TP4.1), Output - Motor Units (6 pins)
Alrt 3.3: Arm Power Distro Board (A) (U13.51), DC-DC Converters (U10.3)
Alrt 5: Arm Power Distro Board (A) (U13.52), DC-DC Converters (U5.3)
Alrt 24: Arm Power Distro Board (A) (F-IN3.2 U13.14), Input (U12.3)
Alrt 24-1: Arm Power Distro Board (A) (U13.13), Output - Motor Units (U15.3)
Alrt 24-2: Arm Power Distro Board (A) (U13.53), Output - Motor Units (U17.3)
Alrt 24-3: Arm Power Distro Board (A) (U13.54), Output - Motor Units (U18.3)
CanH: Arm Power Distro Board (A) (J1.3 J2.3 R19.2 U16.7), Output - Motor Units (6 pins)
CanL: Arm Power Distro Board (A) (J1.4 J2.4 P7.2 U16.6), Output - Motor Units (6 pins)
DIAG_EN: Arm Power Distro Board (A) (F-IN7.2 R67.2 U13.3), Input (R42.2)
EN: Arm Power Distro Board (A) (F-IN8.2 R68.2 U13.4), Input (R43.2)
Fuse LED: Arm Power Distro Board (A) (F-IN2.2), Input (F1.2 R39.1 R40.1 TP12.1)
MU 1: Arm Power Distro Board (A) (F-IN4.2), Input (C22.2 U11.5 U11.6 U11.7), Output - Motor Units (6 pins)
SCL: Arm Power Distro Board (A) (U13.16), DC-DC Converters (R11.1 R36.1 U5.5 U10.5), Input (R46.1 U12.5), Output - Motor Units (6 pins)
SDA: Arm Power Distro Board (A) (U13.15), DC-DC Converters (R12.1 R38.1 U5.4 U10.4), Input (R47.1 U12.4), Output - Motor Units (6 pins)